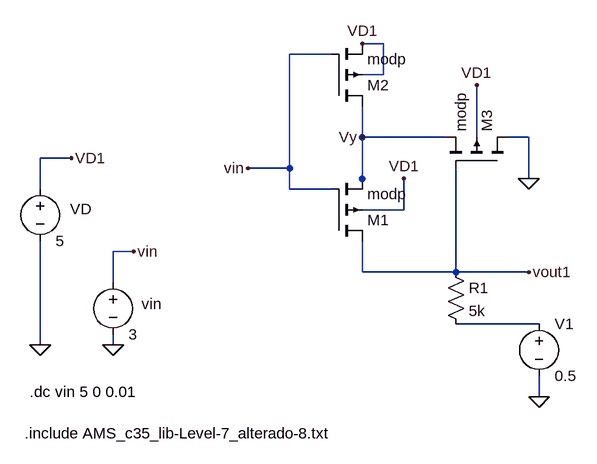
[diagram p0: schematic Schmitt-PMOS.asc]
Schmitt-PMOS.asc, the LTspice schematic file:
Version 4
SHEET 1 1512 1188
WIRE -960 -96 -992 -96
WIRE -1040 -80 -1104 -80
WIRE -960 -48 -960 -96
WIRE -960 -48 -992 -48
WIRE -992 48 -992 0
WIRE -864 48 -992 48
WIRE -816 48 -816 -32
WIRE -736 48 -768 48
WIRE -1440 80 -1488 80
WIRE -1104 96 -1104 -80
WIRE -1104 96 -1168 96
WIRE -992 112 -992 48
WIRE -736 112 -736 48
WIRE -1488 128 -1488 80
WIRE -1104 128 -1104 96
WIRE -1040 128 -1104 128
WIRE -992 128 -992 112
WIRE -928 160 -928 112
WIRE -928 160 -992 160
WIRE -1344 224 -1376 224
WIRE -992 256 -992 208
WIRE -848 256 -848 96
WIRE -848 256 -992 256
WIRE -736 256 -848 256
WIRE -1376 272 -1376 224
WIRE -720 336 -848 336
WIRE -1488 368 -1488 208
WIRE -1376 368 -1376 352
WIRE -720 448 -720 416
FLAG -1488 368 0
FLAG -1440 80 VD1
FLAG -1376 368 0
FLAG -1344 224 vin
FLAG -1168 96 vin
FLAG -736 256 vout1
FLAG -992 -96 VD1
FLAG -736 112 0
FLAG -816 -32 VD1
FLAG -928 112 VD1
FLAG -992 48 Vy
FLAG -720 448 0
SYMBOL voltage -1488 112 R0
WINDOW 0 46 47 Left 2
WINDOW 123 0 0 Left 2
WINDOW 39 0 0 Left 2
SYMATTR InstName VD
SYMATTR Value 5
SYMBOL voltage -1376 256 R0
WINDOW 0 44 49 Left 2
WINDOW 123 0 0 Left 2
WINDOW 39 0 0 Left 2
SYMATTR InstName vin
SYMATTR Value 3
SYMBOL pmos4 -1040 208 M180
SYMATTR InstName M1
SYMATTR Value modp
SYMATTR Value2 l=0.5u w=10u
SYMBOL pmos4 -1040 0 M180
SYMATTR InstName M2
SYMATTR Value modp
SYMATTR Value2 l=0.5u w=10u
SYMBOL pmos4 -768 96 M270
SYMATTR InstName M3
SYMATTR Value modp
SYMATTR Value2 l=0.5u w=10u
SYMBOL res -864 240 R0
SYMATTR InstName R1
SYMATTR Value 5k
SYMBOL voltage -720 320 R0
WINDOW 123 0 0 Left 2
WINDOW 39 0 0 Left 2
SYMATTR InstName V1
SYMATTR Value 0.5
TEXT -1504 440 Left 2 !.dc vin 5 0 0.01
TEXT -1512 504 Left 2 !.include AMS_c35_lib-Level-7_alterado-8.txt

The netlist it stands for:
* Schmitt-PMOS.asc
VD VD1 0 5
vin vin 0 3
M1 vout1 vin Vy VD1 modp l=0.5u w=10u
M2 Vy vin VD1 VD1 modp l=0.5u w=10u
M3 0 vout1 Vy VD1 modp l=0.5u w=10u
R1 vout1 N001 5k
V1 N001 0 0.5
.model NMOS NMOS
.model PMOS PMOS
.lib standard.mos
.dc vin 5 0 0.01
.include AMS_c35_lib-Level-7_alterado-8.txt
.backanno
.end